# Altium schematic sheet MEMMORY.SchDoc
size A4
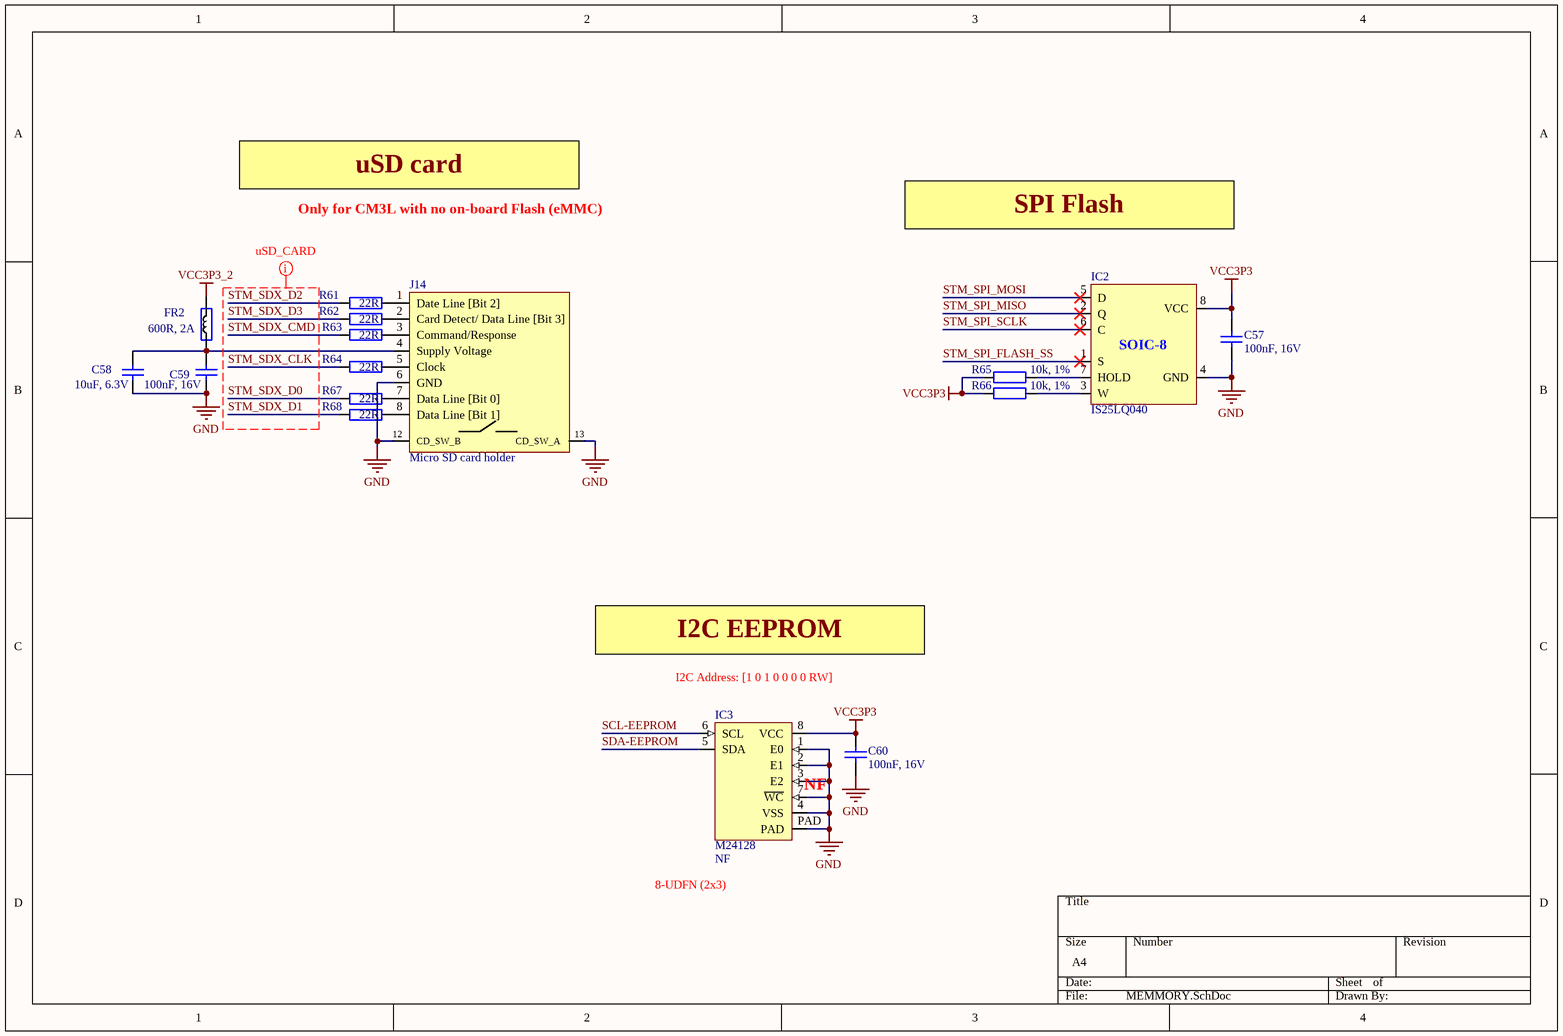
[diagram p0: MEMMORY.SchDoc]

## Parts
C57  100nF, 16V  [CAP0402]
C58  10uF, 6.3V  [CAP0603]
C59  100nF, 16V  [CAP0402]
C60  100nF, 16V  [CAP0402]
FR2  600R, 2A  [RES0805]
IC2  IS25LQ040  [M25P40-VMN6TPB_SO8N]
IC3  M24128  Assembly Info: NF  [M24128-DFMC6TG]
J14  Micro SD card holder  [MICRO_SD_CARD_114-00841-68_v2]
R61  22R  [RES0402]
R62  22R  [RES0402]
R63  22R  [RES0402]
R64  22R  [RES0402]
R65  10k, 1%  [RES0402]
R66  10k, 1%  [RES0402]
R67  22R  [RES0402]
R68  22R  [RES0402]

## Nets
GND: C57.2 C58.1 C59.2 C60.2 IC2.4(GND) IC3.1(E0) IC3.2(E1) IC3.3(E2) IC3.4(VSS) IC3.7(~{WC}) IC3.PAD J14.6(GND) J14.12(CD_SW_B) J14.13(CD_SW_A)
VCC3P3: C57.1 C60.1 IC2.8(VCC) IC3.8(VCC) R65.1 R66.1
VCC3P3_2: FR2.2
SCL-EEPROM: IC3.6(SCL)
SDA-EEPROM: IC3.5(SDA)
STM_SDX_CLK: R64.1
STM_SDX_CMD: R63.1
STM_SDX_D0: R67.1
STM_SDX_D1: R68.1
STM_SDX_D2: R61.1
STM_SDX_D3: R62.1
STM_SPI_FLASH_SS: IC2.1(S)
STM_SPI_MISO: IC2.2(Q)
STM_SPI_MOSI: IC2.5(D)
STM_SPI_SCLK: IC2.6(C)
NetC58_2: C58.2 C59.1 FR2.1 J14.4(Supply_Voltage)
NetIC2_3: IC2.3(W) R66.2
NetIC2_7: IC2.7(HOLD) R65.2
NetJ14_1: J14.1(Date_Line_[Bit_2]) R61.2
NetJ14_2: J14.2(Card_Detect/_Data_Line_[Bit_3]) R62.2
NetJ14_3: J14.3(Command/Response) R63.2
NetJ14_5: J14.5(Clock) R64.2
NetJ14_7: J14.7(Data_Line_[Bit_0]) R67.2
NetJ14_8: J14.8(Data_Line_[Bit_1]) R68.2

## Layout directives
net class uSD_CARD: STM_SDX_CLK, STM_SDX_CMD, STM_SDX_D0, STM_SDX_D1, STM_SDX_D2, STM_SDX_D3

## Notes on the sheet
- uSD card
- Only for CM3L with no on-board Flash (eMMC)
- SPI Flash
- I2C EEPROM
- I2C Address: [1 0 1 0 0 0 0 RW]
- (near IC3) NF
- (near IC3) 8-UDFN (2x3)
- (in symbol M25P40) SOIC-8

## Library data of the parts
C57 C59 = Cap_0603: Manufacturer Part Number 1: GRM155R71C104KA88D; Part Description: CAP CER 0.1UF 16V X7R 0402; Brand: Murata Electronics; Tolerance: 10 %; Type: General Purpose MLCC; Capacitance: 0.1 uF; Temperature Coefficient / Code: +/- 15 %; Supplier 1: Mouser; Supplier Part Number 1: 81-GRM155R71C104KA88; Case Code - in: 0402; Manufacturer: Murata Electronics; Category: Multilayer Ceramic Capacitors MLCC - SMD/SMT; Voltage Rating DC: 16 V; Value: 100nF, 16V
  C57: Manufacturer Part Number: GRM155R71C104KA88D
  C59: Maximum Operating Temperature: + 125 C; Minimum Operating Temperature: - 55 C; Minimum Order Quantity: 1; Operating Temperature Range: - 55 C to + 125 C; Package / Case: 0402 (1005 metric); Packaging: Reel; Product: General Type MLCCs; Product Category: Low & Medium Capacitance SMD Ceramic Chip Capacitors; Reeling: True; RoHS - Mouser: Y; RoHS: RoHS Compliant; Series: GRM; Standard Pack Qty: 10000; Termination Style: SMD/SMT
C58 = Cap_0603: Manufacturer Part Number 1: CC0603MRX5R5BB106; Manufacturer: Yageo; Part Description: 10µF ±20% 6.3V X5R Ceramic Capacitor -55°C ~ 85°C Surface Mount, MLCC 0603 (1608 Metric) 0.063" L x 0.031" W (1.60mm x 0.80mm); Capacitance: 10µF; Tolerance: ±20%; Supplier 1: Digi-Key; Supplier Part Number 1: 311-1448-2-ND; Package / Case: 0603 (1608 Metric); Category: Capacitors; Voltage - Rated: 6.3V; Value: 10uF, 6.3V
C60 = Cap_0603: Manufacturer Part Number 1: GRM155R71C104KA88D; Part Description: CAP CER 0.1UF 16V X7R 0402; Brand: Murata Electronics; Tolerance: 10 %; Type: General Purpose MLCC; Capacitance: 0.1 uF; Temperature Coefficient / Code: +/- 15 %; Case Height: 0.5 mm; Case Length: 1 mm; Dielectric: X7R; Supplier 1: Mouser; Supplier Part Number 1: 81-GRM155R71C104KA88; Case Code - in: 0402; Manufacturer: Murata Electronics; Category: Multilayer Ceramic Capacitors MLCC - SMD/SMT; Voltage Rating DC: 16 V; Value: 100nF, 16V; Manufacturer Part Number: GRM155R71C104KA88D; Case Code - mm: 1005; Case Width: 0.5 mm; Maximum Operating Temperature: + 125 C; Minimum Operating Temperature: - 55 C; Minimum Order Quantity: 1; Operating Temperature Range: - 55 C to + 125 C; Package / Case: 0402 (1005 metric); Packaging: Reel; Product: General Type MLCCs; Product Category: Low & Medium Capacitance SMD Ceramic Chip Capacitors; Reeling: True; RoHS - Mouser: Y; RoHS: RoHS Compliant; Series: GRM; Standard Pack Qty: 10000; Termination Style: SMD/SMT
FR2 = Ferrite: Manufacturer Part Number 1: MPZ2012S601AT000; Manufacturer: TDK Corporation; Part Description: FERRITE BEAD 600 OHM 0805 1LN; Filter Type: Differential Mode - Single; Impedance @ Frequency: 600 Ohm @ 100MHz; DC Resistance (DCR): 100 mOhm Max; Supplier 1: Digi-Key; Supplier Part Number 1: 445-2206-2-ND; Mounting Type: Surface Mount; RoHS: RoHS Compliant; Height (Max): 0.041" (1.05mm); Packaging: Tape & Reel (TR); Category: Filters; Current Rating: 2A; Package / Case: 0805 (2012 Metric); Size / Dimension: 0.079" L x 0.049" W (2.00mm x 1.25mm)
IC2 = M25P40: Manufacturer Part Number 1: IS25LQ040B-JNLE; Manufacturer: ISSI, Integrated Silicon Solution Inc; Part Description: FLASH - NOR Memory IC 4Mb (512K x 8) SPI - Quad I/O 104MHz  8-SOIC; Memory Type: Non-Volatile; Memory Format: FLASH; Memory Size: 4Mb (512K x 8); Write Cycle Time - Word, Page: 800µs; Memory Interface: SPI - Quad I/O; Voltage - Supply: 2.3 V ~ 3.6 V; Category: Integrated Circuits (ICs); Supplier Part Number 1: 706-1316-ND; Supplier 1: Digi-Key; RoHS: RoHS Compliant; Packaging: Bulk; Part Status: Active; Technology: FLASH - NOR; Operating Temperature: -40°C ~ 105°C (TA); Mounting Type: Surface Mount; Package / Case: 8-SOIC (0.154", 3.90mm Width); Supplier Device Package: 8-SOIC; Value: IS25LQ040
IC3 = M24128-DFMC6TG: Manufacturer: STMicroelectronics; Part Description: EEPROM Memory IC 128Kb (16K x 8) I²C 1MHz 450ns 8-UFDFPN (2x3); Memory Type: Non-Volatile; Memory Format: EEPROM; Memory Size: 128Kb (16K x 8); Write Cycle Time - Word, Page: 5ms; Memory Interface: I²C; Voltage - Supply: 1.7 V ~ 5.5 V; Supplier 1: Digi-Key; Manufacturer Part Number 1: M24128-DFMC6TG; RoHS: RoHS Compliant; Category: Integrated Circuits (ICs); Stock 1: 5894; Pricing 1: 1=0.35, 10=0.348, 100=0.2854, 500=0.27748, 1000=0.27004 (USD); Packaging: Cut Tape (CT); Part Status: Active; Technology: EEPROM; Operating Temperature: -40°C ~ 85°C (TA); Mounting Type: Surface Mount; Package / Case: 8-UFDFN Exposed Pad; Supplier Device Package: 8-UFDFPN (2x3); ComponentLink1URL: http://www.st.com/content/ccc/resource/technical/document/datasheet/59/05/c9/5b/7b/41/48/b6/CD00259167.pdf/files/CD00259167.pdf/jcr:content/translations/en.CD00259167.pdf; ComponentLink1Description: http://www.st.com/content/ccc/resource/technical/document/datasheet/59/05/c9/5b/7b/41/48/b6/CD00259167.pdf/files/CD00259167.pdf/jcr:content/translations/en.CD00259167.pdf; Supplier Part Number 1: 497-15739-1-ND
J14 = MICRO_SD_114-00841-68: Manufacturer: Amphenol Commercial Products; Part Description: 10 (8 + 2) Position Card Connector Secure Digital - microSD™ Surface Mount, Right Angle Gold; Card Type: Secure Digital - microSD™; Number of Positions: 10 (8 + 2); Connector Type: Connector; Insertion, Removal Method: Push In, Pull Out; Supplier 1: Digi-Key; Manufacturer Part Number 1: 114-00841-68; RoHS: RoHS Compliant; Category: Connectors, Interconnects; Stock 1: 5866; Pricing 1: 1=1.5, 10=1.358, 25=1.2752, 50=1.2196, 100=1.1642, 250=1.05336, 500=0.9702 (USD); Packaging: Cut Tape (CT); Part Status: Active; Ejector Side: -; Mounting Type: Surface Mount, Right Angle; Features: Switch; Height Above Board: 0.061" (1.55mm); Mounting Feature: Normal, Standard - Top; Contact Finish: Gold; Contact Finish Thickness: 15.0µin (0.38µm); ComponentLink1URL: https://www.amphenolcanada.com/ProductSearch/drawings/AC/1140084168.pdf; ComponentLink1Description: https://www.amphenolcanada.com/ProductSearch/drawings/AC/1140084168.pdf; Supplier Part Number 1: 114-00841-68-1-ND
R61-R64 R67 R68 = Res_0402: Part Description: RES SMD 22 OHM 1% 1/16W 0402; Manufacturer Part Number 1: RC0402FR-0722RL; Manufacturer: Yageo; Tolerance: ±1%; Temperature Coefficient: ±100ppm/°C; Resistance (Ohms): 22; Supplier 1: Digi-Key; Supplier Part Number 1: 311-22.0LRTR-ND; Supplier Device Package: 0402; Composition: Thick Film; Category: Resistors; Value: 22R
R65 R66 = Res_0402: Manufacturer: Yageo; Manufacturer Part Number 1: RC0402FR-0710KL; Part Description: RES SMD 10K OHM 1% 1/16W 0402; Temperature Coefficient: ±100ppm/°C; Power (Watts): 0.063W, 1/16W; Value: 10k, 1%; Supplier 1: Digi-Key; Supplier Part Number 1: 311-10.0KLRTR-ND; Resistance (Ohms): 10k; Packaging: Tape & Reel (TR); RoHS: RoHS Compliant; Package / Case: 0402 (1005 Metric); Tolerance: ±1%; Operating Temperature: -55°C ~ 155°C; Size / Dimension: 0.039" L x 0.020" W (1.00mm x 0.50mm); Number of Terminations: 2; Category: Resistors; Height: 0.016" (0.40mm); Supplier Device Package: 0402; Features: Moisture Resistant; Composition: Thick Film